# EAGLE design PUCY_Etap3 (EAGLE 5.11)
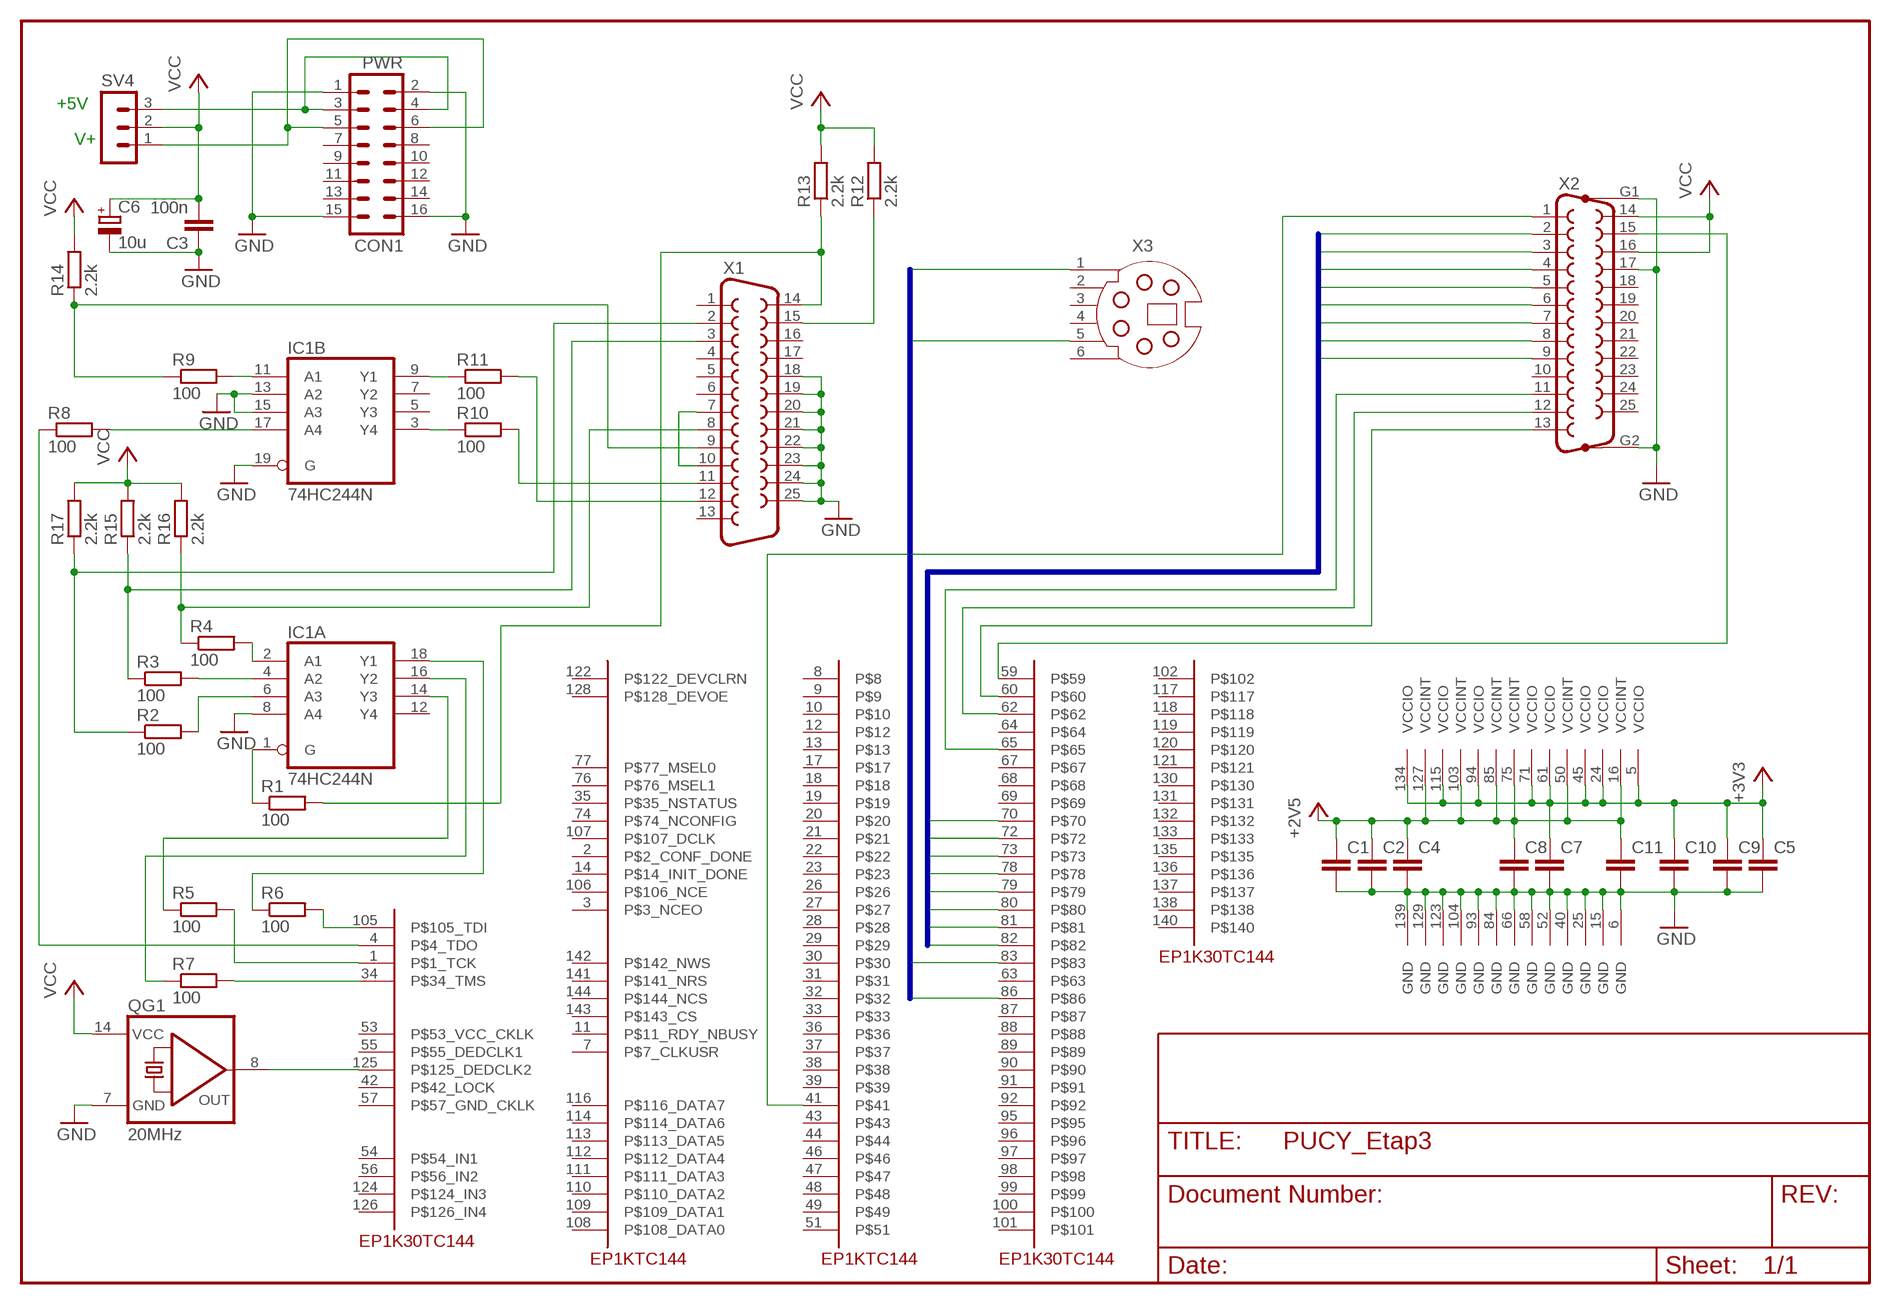
[diagram p0: schematic, sheet 1]

## Parts
C1  C-EUC0805  [C0805]
C2  C-EUC0805  [C0805]
C3  100n  C-EUC0805  [C0805]
C4  C-EUC0805  [C0805]
C5  C-EUC0805  [C0805]
C6  10u  CPOL-EUB/3528-21W  [B/3528-21W]
C7  C-EUC0805  [C0805]
C8  C-EUC0805  [C0805]
C9  C-EUC0805  [C0805]
C10  C-EUC0805  [C0805]
C11  C-EUC0805  [C0805]
CON1  PWR  ML16  [ML16]
IC1  74HC244N  [DIL20]
QG1  20MHz  QG5860  [DIL14S]
R1  100  R-EU_R0805  [R0805]
R2  100  R-EU_R0805  [R0805]
R3  100  R-EU_R0805  [R0805]
R4  100  R-EU_R0805  [R0805]
R5  100  R-EU_R0805  [R0805]
R6  100  R-EU_R0805  [R0805]
R7  100  R-EU_R0805  [R0805]
R8  100  R-EU_R0805  [R0805]
R9  100  R-EU_R0805  [R0805]
R10  100  R-EU_R0805  [R0805]
R11  100  R-EU_R0805  [R0805]
R12  2.2k  R-EU_R0805  [R0805]
R13  2.2k  R-EU_R0805  [R0805]
R14  2.2k  R-EU_R0805  [R0805]
R15  2.2k  R-EU_R0805  [R0805]
R16  2.2k  R-EU_R0805  [R0805]
R17  2.2k  R-EU_R0805  [R0805]
SV4  MA03-1  [MA03-1]
U$1  PAWLA_EP1K30TC144  [PAWLA_TQFP144]
X1  F25HP  [F25HP]
X2  F25HP  [F25HP]
X3  MDSSV-BC06  [SSV-BC06]

## Nets
+3V3: C5.1 C7.1 C9.1 C10.1 U$1.5(VCCIO) U$1.24(VCCIO) U$1.45(VCCIO) U$1.61(VCCIO) U$1.71(VCCIO) U$1.94(VCCIO) U$1.115(VCCIO) U$1.134(VCCIO)
+5V: C1.1 C2.1 C4.1 C8.1 C11.1 U$1.16(VCCINT) U$1.50(VCCINT) U$1.75(VCCINT) U$1.85(VCCINT) U$1.103(VCCINT) U$1.127(VCCINT) ; supply symbol labelled +2V5
GND: C1.2 C2.2 C3.1 C4.2 C5.2 C6.- C7.2 C8.2 C9.2 C10.2 C11.2 CON1.1 CON1.2 CON1.15 CON1.16 IC1.8(A:A4) IC1.13(B:A2) IC1.15(B:A3) IC1.19(B:G) QG1.7(GND) U$1.6(GND) U$1.15(GND) U$1.25(GND) U$1.40(GND) U$1.52(GND) U$1.58(GND) U$1.66(GND) U$1.84(GND) U$1.93(GND) U$1.104(GND) U$1.123(GND) U$1.129(GND) U$1.139(GND) X1.18 X1.19 X1.20 X1.21 X1.22 X1.23 X1.24 X1.25 X2.17 X2.G1 X2.G2
LPT_D0: U$1.70 X2.2
LPT_D1: U$1.72 X2.3
LPT_D2: U$1.73 X2.4
LPT_D3: U$1.78 X2.5
LPT_D4: U$1.79 X2.6
LPT_D5: U$1.80 X2.7
LPT_D6: U$1.81 X2.8
LPT_D7: U$1.82 X2.9
N$1: QG1.8(OUT) U$1.125(P$125_DEDCLK2)
N$2: IC1.14(A:Y3) R5.1
N$3: R5.2 U$1.1(P$1_TCK)
N$4: CON1.5 CON1.6 SV4.1
N$5: R7.2 U$1.34(P$34_TMS)
N$7: R6.2 U$1.105(P$105_TDI)
N$8: CON1.3 CON1.4 SV4.3
N$9: IC1.16(A:Y2) R7.1
N$10: R1.2 R13.1 X1.14
N$11: IC1.11(B:A1) R9.2
N$12: IC1.17(B:A4) R8.2
N$13: IC1.2(A:A1) R4.2
N$14: IC1.4(A:A2) R3.2
N$15: IC1.6(A:A3) R2.2
N$16: IC1.1(A:G) R1.1
N$17: R9.1 R14.1 X1.9
N$18: R4.1 R16.1 X1.8
N$19: R3.1 R15.1 X1.3
N$21: IC1.18(A:Y1) R6.1
N$22: R8.1 U$1.4(P$4_TDO)
N$23: IC1.3(B:Y4) R10.1
N$24: R10.2 X1.11
N$25: X1.7 X1.10
N$26: IC1.9(B:Y1) R11.1
N$27: R11.2 X1.12
N$28: R2.1 R17.1 X1.2
N$31: R12.1 X1.15
N$34: U$1.65 X2.11
N$35: U$1.62 X2.12
N$36: U$1.60 X2.13
N$37: U$1.59 X2.15
N$48: U$1.41 X2.1
PS_BUS0: U$1.83 X3.1
PS_BUS1: U$1.86 X3.5
VCC: C3.2 C6.+ QG1.14(VCC) R12.2 R13.2 R14.2 R15.2 R16.2 R17.2 SV4.2 X2.14 X2.16
Unconnected: CON1.7 CON1.8 CON1.9 CON1.10 CON1.11 CON1.12 CON1.13 CON1.14 IC1.5(B:Y3) IC1.7(B:Y2) IC1.12(A:Y4) U$1.2(P$2_CONF_DONE) U$1.3(P$3_NCEO) U$1.7(P$7_CLKUSR) U$1.8 U$1.9 U$1.10 U$1.11(P$11_RDY_NBUSY) U$1.12 U$1.13 U$1.14(P$14_INIT_DONE) U$1.17 U$1.18 U$1.19 U$1.20 U$1.21 U$1.22 U$1.23 U$1.26 U$1.27 U$1.28 U$1.29 U$1.30 U$1.31 U$1.32 U$1.33 U$1.35(P$35_NSTATUS) U$1.36 U$1.37 U$1.38 U$1.39 U$1.42(P$42_LOCK) U$1.43 U$1.44 U$1.46 U$1.47 U$1.48 U$1.49 U$1.51 U$1.53(P$53_VCC_CKLK) U$1.54(P$54_IN1) U$1.55(P$55_DEDCLK1) U$1.56(P$56_IN2) U$1.57(P$57_GND_CKLK) U$1.63 U$1.64 U$1.67 U$1.68 U$1.69 U$1.74(P$74_NCONFIG) U$1.76(P$76_MSEL1) U$1.77(P$77_MSEL0) U$1.87 U$1.88 U$1.89 U$1.90 U$1.91 U$1.92 U$1.95 U$1.96 U$1.97 U$1.98 U$1.99 U$1.100 U$1.101 U$1.102 U$1.106(P$106_NCE) U$1.107(P$107_DCLK) U$1.108(P$108_DATA0) U$1.109(P$109_DATA1) U$1.110(P$110_DATA2) U$1.111(P$111_DATA3) U$1.112(P$112_DATA4) U$1.113(P$113_DATA5) U$1.114(P$114_DATA6) U$1.116(P$116_DATA7) U$1.117 U$1.118 U$1.119 U$1.120 U$1.121 U$1.122(P$122_DEVCLRN) U$1.124(P$124_IN3) U$1.126(P$126_IN4) U$1.128(P$128_DEVOE) U$1.130 U$1.131 U$1.132 U$1.133 U$1.135 U$1.136 U$1.137 U$1.138 U$1.140 U$1.141(P$141_NRS) U$1.142(P$142_NWS) U$1.143(P$143_CS) U$1.144(P$144_NCS) X1.1 X1.4 X1.5 X1.6 X1.13 X1.16 X1.17 X2.10 X2.18 X2.19 X2.20 X2.21 X2.22 X2.23 X2.24 X2.25 X3.2 X3.3 X3.4 X3.6

## Buses
LPT_D[0..7]
PS_BUS[0..1]

## Notes on the sheet
- +5V
- V+

## Power pins joined to a net without a drawn wire
GND: IC1.10(P:GND)
VCC: IC1.20(P:VCC)

## Library data of the parts
C1 C2 C4 C5 C7-C11 = resistor:C-EU: CAPACITOR, European symbol
C3 = rcl:C-EU: CAPACITOR, European symbol
C6 = rcl:CPOL-EU: POLARIZED CAPACITOR, European symbol
CON1 = con-ml:ML16: HARTING
IC1 = 74xx-eu:74*244: Octal BUFFER and LINE DRIVER, 3-state
QG1 = crystal:QG5860: CRYSTAL RESONATOR; OC_FARNELL: unknown; OC_NEWARK: unknown
R1-R17 = rcl:R-EU_: RESISTOR, European symbol
SV4 = con-lstb:MA03-1: PIN HEADER
U$1 = EP1K30TC144:PAWLA_EP1K30TC144
X1 = con-subd:F25: SUB-D; OC_FARNELL: unknown; OC_NEWARK: unknown
X2 = con-subd:F25HP: SUB-D; OC_FARNELL: unknown; OC_NEWARK: unknown
X3 = con-yamaichi:MDSSV-BC06: YAMAICHI CONNECTOR; OC_FARNELL: unknown; OC_NEWARK: unknown

## Board
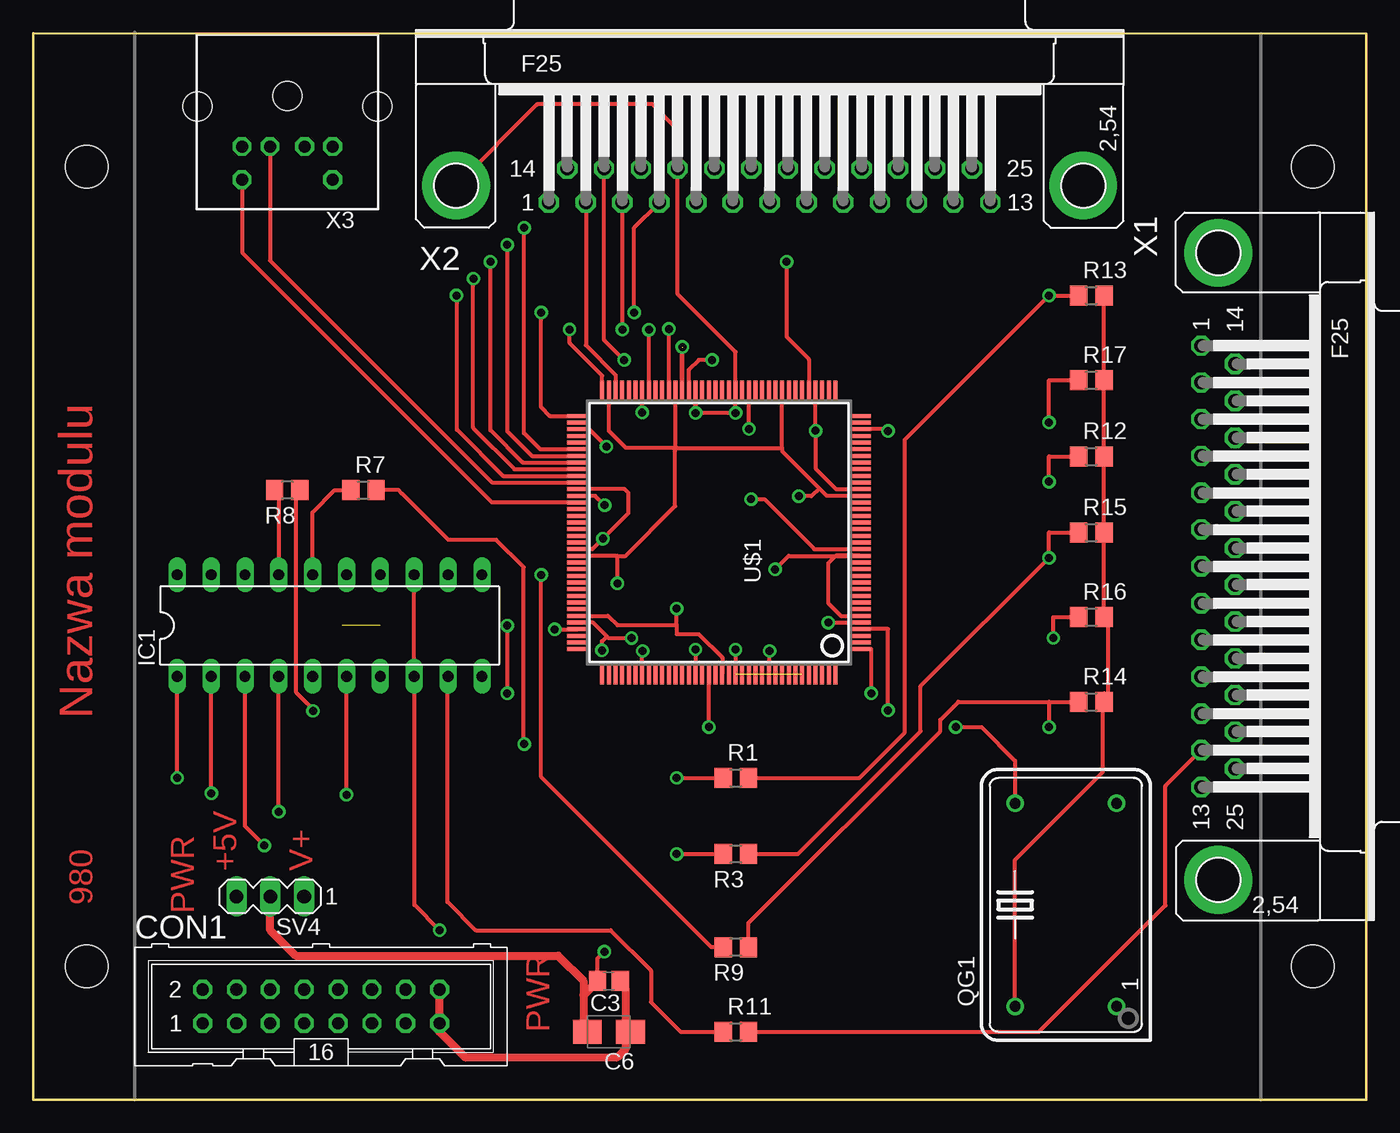
[diagram p1: board, top side]
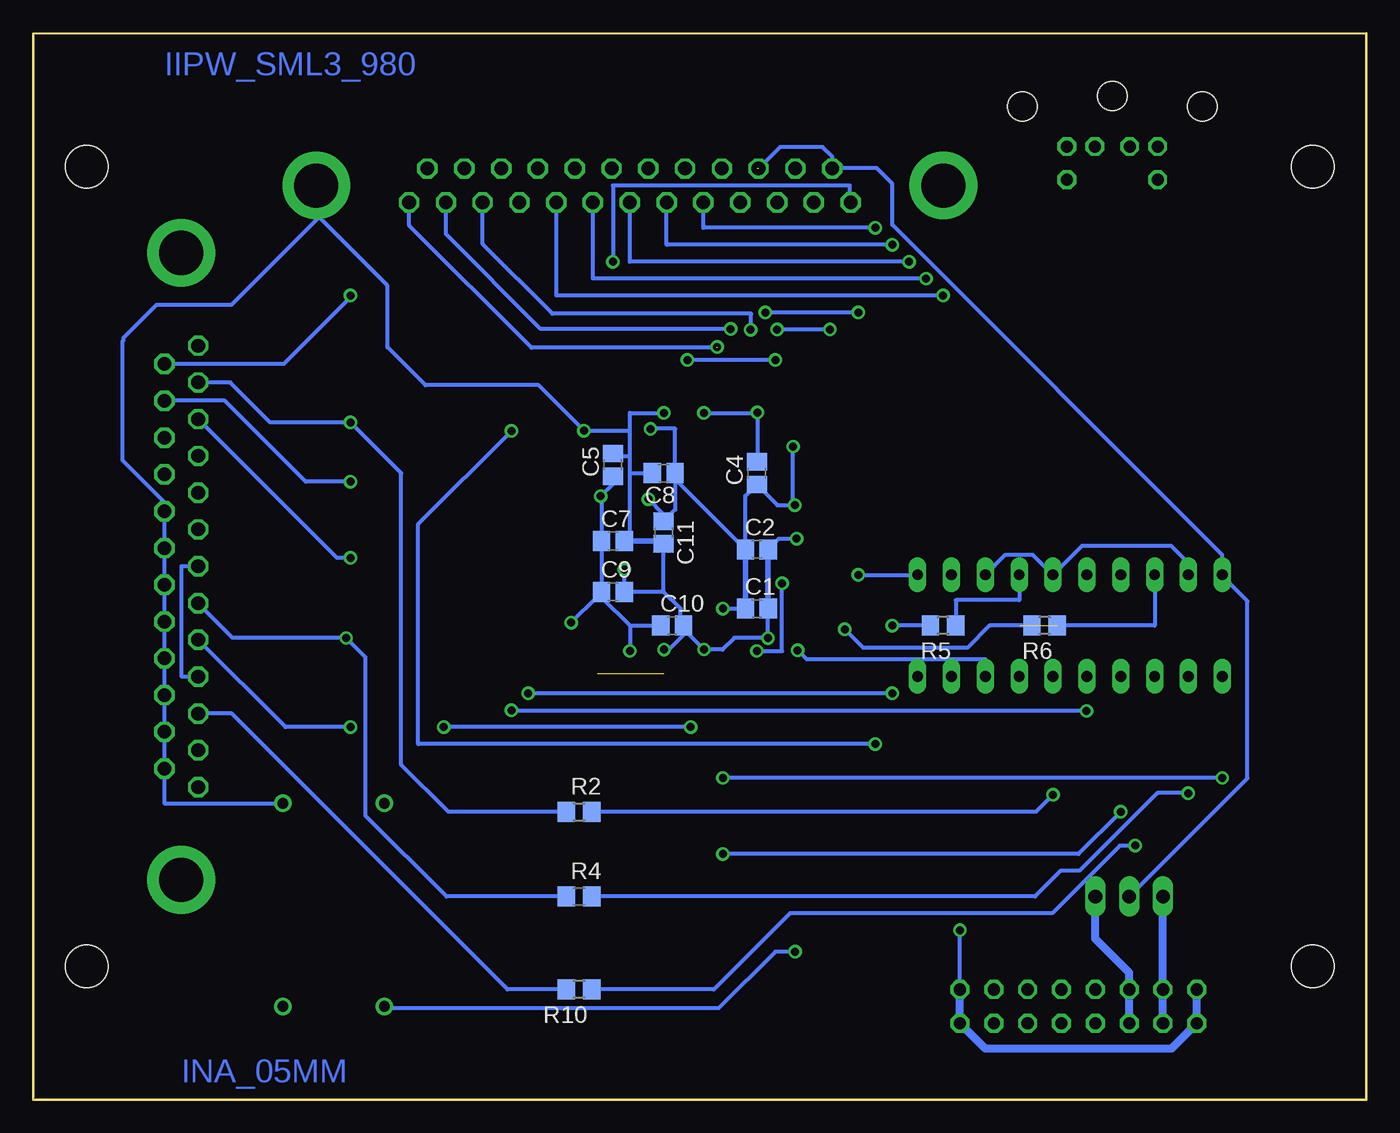
[diagram p2: board, bottom side, seen from below]

Size 100 x 80 mm. Coordinates in mm from the lower left corner, seen from the top.
Outline: 0,0 100,0 100,79.98 0,80 0,0
Copper layers (1*16): Top 0.035mm / dielectric 1.5mm / Bottom 0.035mm
Design rules "default *": minimum track width 10mil, minimum drill 23mil, track to track 5mil, track to pad 5mil, pad to pad 5mil, via to via 5mil, smd to smd 5mil, copper to edge 40mil, drill to drill 8mil, minimum pad ring 10mil, minimum via ring 8mil, stop-mask expansion 4mil, vias tented up to drill 0mil, thermal gap 10mil
Holes 3.2 mm at 4,10 4,70 96,10 96,70

### Footprints (pad centres in the part's own frame; a part is rotated, then mirrored left to right if it is on the bottom)
C0805 = smd 1.3 x 1.5: 1 -0.85,0; 2 0.85,0
B/3528-21W = smd 2.15 x 1.8: + 1.625,0; - -1.625,0
ML16 = drill 0.914 octagon: 1 -8.89,-1.27; 2 -8.89,1.27; 3 -6.35,-1.27; 4 -6.35,1.27; 5 -3.81,-1.27; 6 -3.81,1.27; 7 -1.27,-1.27; 8 -1.27,1.27; 9 1.27,-1.27; 10 1.27,1.27; 11 3.81,-1.27; 12 3.81,1.27; 13 6.35,-1.27; 14 6.35,1.27; 15 8.89,-1.27; 16 8.89,1.27
DIL20 = drill 0.813 long: 1 -11.43,-3.81; 2 -8.89,-3.81; 3 -6.35,-3.81; 4 -3.81,-3.81; 5 -1.27,-3.81; 6 1.27,-3.81; 7 3.81,-3.81; 8 6.35,-3.81; 9 8.89,-3.81; 10 11.43,-3.81; 11 11.43,3.81; 12 8.89,3.81; 13 6.35,3.81; 14 3.81,3.81; 15 1.27,3.81; 16 -1.27,3.81; 17 -3.81,3.81; 18 -6.35,3.81; 19 -8.89,3.81; 20 -11.43,3.81
DIL14S = drill 0.813 round: 1 -7.62,-3.81; 7 7.62,-3.81; 8 7.62,3.81; 14 -7.62,3.81
R0805 = smd 1.3 x 1.5: 1 -0.95,0; 2 0.95,0
MA03-1 = drill 1.016 long: 1 -2.54,0; 2 0,0; 3 2.54,0
PAWLA_TQFP144 = smd 0.3 x 1.6: 1 -8.75,-10.6; 2 -8.25,-10.6; 3 -7.75,-10.6; 4 -7.25,-10.6; 5 -6.75,-10.6; 6 -6.25,-10.6; 7 -5.75,-10.6; 8 -5.25,-10.6; 9 -4.75,-10.6; 10 -4.25,-10.6; 11 -3.75,-10.6; 12 -3.25,-10.6; 13 -2.75,-10.6; 14 -2.25,-10.6; 15 -1.75,-10.6; 16 -1.25,-10.6; 17 -0.75,-10.6; 18 -0.25,-10.6; 19 0.25,-10.6; 20 0.75,-10.6; 21 1.25,-10.6; 22 1.75,-10.6; 23 2.25,-10.6; 24 2.75,-10.6; 25 3.25,-10.6; 26 3.75,-10.6; 27 4.25,-10.6; 28 4.75,-10.6; 29 5.25,-10.6; 30 5.75,-10.6; 31 6.25,-10.6; 32 6.75,-10.6; 33 7.25,-10.6; 34 7.75,-10.6; 35 8.25,-10.6; 36 8.75,-10.6; 73 8.75,10.6; 74 8.25,10.6; 75 7.75,10.6; 76 7.25,10.6; 77 6.75,10.6; 78 6.25,10.6; 79 5.75,10.6; 80 5.25,10.6; 81 4.75,10.6; 82 4.25,10.6; 83 3.75,10.6; 84 3.25,10.6; 85 2.75,10.6; 86 2.25,10.6; 87 1.75,10.6; 88 1.25,10.6; 89 0.75,10.6; 90 0.25,10.6; 91 -0.25,10.6; 92 -0.75,10.6; 93 -1.25,10.6; 94 -1.75,10.6; 95 -2.25,10.6; 96 -2.75,10.6; 97 -3.25,10.6; 98 -3.75,10.6; 99 -4.25,10.6; 100 -4.75,10.6; 101 -5.25,10.6; 102 -5.75,10.6; 103 -6.25,10.6; 104 -6.75,10.6; 105 -7.25,10.6; 106 -7.75,10.6; 107 -8.25,10.6; 108 -8.75,10.6 | smd 1.6 x 0.3: 37 10.6,-8.75; 38 10.6,-8.25; 39 10.6,-7.75; 40 10.6,-7.25; 41 10.6,-6.75; 42 10.6,-6.25; 43 10.6,-5.75; 44 10.6,-5.25; 45 10.6,-4.75; 46 10.6,-4.25; 47 10.6,-3.75; 48 10.6,-3.25; 49 10.6,-2.75; 50 10.6,-2.25; 51 10.6,-1.75; 52 10.6,-1.25; 53 10.6,-0.75; 54 10.6,-0.25; 55 10.6,0.25; 56 10.6,0.75; 57 10.6,1.25; 58 10.6,1.75; 59 10.6,2.25; 60 10.6,2.75; 61 10.6,3.25; 62 10.6,3.75; 63 10.6,4.25; 64 10.6,4.75; 65 10.6,5.25; 66 10.6,5.75; 67 10.6,6.25; 68 10.6,6.75; 69 10.6,7.25; 70 10.6,7.75; 71 10.6,8.25; 72 10.6,8.75; 109 -10.6,8.75; 110 -10.6,8.25; 111 -10.6,7.75; 112 -10.6,7.25; 113 -10.6,6.75; 114 -10.6,6.25; 115 -10.6,5.75; 116 -10.6,5.25; 117 -10.6,4.75; 118 -10.6,4.25; 119 -10.6,3.75; 120 -10.6,3.25; 121 -10.6,2.75; 122 -10.6,2.25; 123 -10.6,1.75; 124 -10.6,1.25; 125 -10.6,0.75; 126 -10.6,0.25; 127 -10.6,-0.25; 128 -10.6,-0.75; 129 -10.6,-1.25; 130 -10.6,-1.75; 131 -10.6,-2.25; 132 -10.6,-2.75; 133 -10.6,-3.25; 134 -10.6,-3.75; 135 -10.6,-4.25; 136 -10.6,-4.75; 137 -10.6,-5.25; 138 -10.6,-5.75; 139 -10.6,-6.25; 140 -10.6,-6.75; 141 -10.6,-7.25; 142 -10.6,-7.75; 143 -10.6,-8.25; 144 -10.6,-8.75
F25HP = drill 1.016 octagon: 1 -16.561,-1.27; 2 -13.792,-1.27; 3 -11.049,-1.27; 4 -8.28,-1.27; 5 -5.512,-1.27; 6 -2.769,-1.27; 7 0,-1.27; 8 2.769,-1.27; 9 5.512,-1.27; 10 8.28,-1.27; 11 11.049,-1.27; 12 13.792,-1.27; 13 16.561,-1.27; 14 -15.189,1.27; 15 -12.421,1.27; 16 -9.652,1.27; 17 -6.909,1.27; 18 -4.14,1.27; 19 -1.372,1.27; 20 1.372,1.27; 21 4.14,1.27; 22 6.909,1.27; 23 9.652,1.27; 24 12.421,1.27; 25 15.189,1.27 | drill 3.302 pad 5.08 round: G1 -23.52,0; G2 23.52,0
SSV-BC06 = drill 0.9 octagon: 1 1.3,8.5; 2 -1.3,8.5; 3 3.4,8.5; 4 -3.4,8.5; 5 3.4,11; 6 -3.4,11 | hole 2.2: -6.75,5.5; 0,4.7; 6.75,5.5

### Placement (x,y rotation side)
C1  45.72,36.83 0 bottom
C2  45.72,41.27 0 bottom
C3  43.18,8.89 180 top
C4  45.72,46.99 90 bottom
C5  56.52,47.62 90 bottom
C6  43.18,5.08 180 top
C7  56.52,41.91 0 bottom
C8  52.7,46.99 180 bottom
C9  56.52,38.1 0 bottom
C10  52.07,35.56 0 bottom
C11  52.7,42.55 270 bottom
CON1  21.59,6.99 0 top
IC1  22.23,35.56 0 top
QG1  77.47,14.61 90 top
R1  52.7,24.13 0 top
R2  59.05,21.59 0 bottom
R3  52.7,18.41 180 top
R4  59.05,15.24 0 bottom
R5  31.75,35.56 180 bottom
R6  24.13,35.56 180 bottom
R7  24.77,45.72 0 top
R8  19.05,45.72 180 top
R9  52.7,11.43 180 top
R10  59.05,8.26 180 bottom
R11  52.7,5.08 0 top
R12  79.38,48.26 0 top
R13  79.38,60.33 0 top
R14  79.38,29.84 0 top
R15  79.38,42.55 0 top
R16  79.38,36.2 0 top
R17  79.38,53.98 0 top
SV4  17.78,15.24 180 top
U$1  51.44,42.55 90 top
X1  88.9,40.01 270 top
X2  55.24,68.58 0 top
X3  19.05,80.01 180 top

### Tracks (layer width: path | path; a pad name or v marks a point on that pad's centre or on a via)
+3V3  (via drill 0.6)
  Top 0.305: U$1.71 43.18,50.16 44.45,48.9 48.19,48.9 | 48.19,48.9 U$1.61 | 43.81,40.8 U$1.94 | v43.81,38.73 43.81,40.8 | v45.72,33.66 45.69,33.66 U$1.115 | v55.24,33.66 55.19,33.66 U$1.134 | U$1.45 | 56.19,48.9 56.19,48.64 58.97,45.86 | 56.19,48.9 U$1.45 | 58.97,45.86 59.52,45.3 U$1.24 | v57.43,45.26 58.37,45.26 58.97,45.86 | 48.32,48.9 56.19,48.9 | 48.32,48.9 48.19,48.9 | v59.65,35.79 U$1.5 | 48.32,48.9 48.16,48.73 48.16,44.51 44.44,40.8 43.81,40.8
  Bottom 0.305: v43.81,38.73 43.81,33.66 v45.72,33.66 | 55.24,35.56 C10.1 | 55.24,35.56 v55.24,33.66 | C5.1 56.52,46.18 v57.43,45.26 57.37,45.2 C7.1 C9.1 57.37,37.68 | 57.37,37.68 55.24,35.56 | 57.37,37.68 57.76,37.68 v59.65,35.79
+5V  (via drill 0.6)
  Top 0.305: 48.26,35.62 v48.26,36.83 | 48.26,35.62 48.26,34.92 49.92,34.92 51.69,33.16 U$1.127 | v53.7,50.32 53.69,50.32 U$1.50 | U$1.103 43.12,36.3 43.81,35.6 48.23,35.6 48.26,35.62 | v53.86,45.05 54.84,45.05 58.6,41.29 62.03,41.29 U$1.16 | U$1.85 42.16,45.3 v42.86,44.59 | U$1.75 41.69,50.3 v42.99,49
  Bottom 0.305: v48.26,36.83 C1.1 | C8.1 | C8.1 51.84,50.33 v53.7,50.33 v53.7,50.32 | 51.84,46.55 C8.1 | 51.84,46.55 C2.1 46.57,45.29 C4.1 44.17,44.59 v42.86,44.59 42.99,44.72 v42.99,49 | 51.84,46.55 51.84,44.26 C11.1 52.7,43.89 v53.86,45.05
  Bottom 0.406: C1.1 C2.1
GND  (via drill 0.6)  (1 unrouted)
  Top 0.305: IC1.13 IC1.8 28.59,14.59 v30.48,12.7 | X2.G1 37.81,74.66 46.46,74.66 48.31,72.81 48.31,69.85 X2.17 48.34,60.44 52.69,56.08 U$1.52 v52.69,51.51 49.69,51.51 U$1.58 v49.7,51.52 | v58.69,50.19 | v58.69,50.19 U$1.40 | v45.68,51.55 v45.69,51.55 U$1.66 | v49.68,33.77 U$1.123 | U$1.129 v52.69,33.75 v52.68,33.76 | v58.69,50.19 58.69,47.35 60.24,45.8 U$1.25 | U$1.6 60.59,36.3 59.63,37.26 59.63,40.22 60.21,40.8 62.02,40.8 U$1.15 56.67,40.8 v55.65,39.78 | v44.88,34.62 43.18,34.62 43.04,34.76 | 43.04,34.76 42.01,35.79 U$1.104 | U$1.93 41.95,41.3 v42.74,42.08 v42.74,42.09 44.65,44.01 44.65,45.52 44.37,45.8 U$1.84 | v42.66,33.71 42.66,34.38 43.04,34.76
  Top 0.61: CON1.16 CON1.15 30.48,5.08 32.38,3.17 43.81,3.17 44.45,3.81 44.45,5.08 | 44.45,5.08 C6.- | C3.1 43.81,8.89 44.45,8.26 44.45,5.08
  Bottom 0.305: 55.24,48.26 55.24,50.16 | 52.7,38.1 C9.2 55.65,38.11 v55.65,39.78 | IC1.8 28.57,33.02 33.66,33.02 | 33.66,33.02 IC1.10 | CON1.16 v30.48,12.7 | QG1.7 90.17,22.23 X1.25 X1.24 X1.23 X1.22 X1.21 X1.20 X1.19 X1.18 90.17,44.83 93.32,47.98 93.32,56.87 93.24,56.95 93.24,57.15 90.78,59.61 85.14,59.61 78.56,66.19 | 52.7,38.1 C11.2 | 55.24,48.26 56.52,48.26 | 55.24,46.99 55.24,48.26 | 55.24,46.99 C8.2 | X2.G2 78.77,66.4 78.56,66.19 | 78.56,66.19 73.43,61.06 73.43,56.44 70.59,53.59 62.09,53.59 v58.69,50.19 58.69,50.16 55.24,50.16 | v49.7,51.52 45.68,51.52 v45.68,51.55 45.68,47.84 C4.2 | v52.69,51.51 55.24,51.51 55.24,50.16 | 51,35.08 v49.68,33.77 49.67,33.76 48.28,33.76 47.41,34.63 44.87,34.63 | 51,35.08 51.44,35.52 51.44,35.56 51.44,36.83 52.7,38.1 | v52.68,33.76 52.32,33.76 51,35.08 | 55.24,46.99 55.24,42.33 C7.2 | 44.87,34.63 C1.2 | v44.88,34.62 44.87,34.63 | v42.74,42.08 44.07,42.08 C2.2 | 33.66,33.02 41.97,33.02 v42.66,33.71 | IC1.19 13.34,40.26 14.64,41.57 21.3,41.57 IC1.15 23.52,39.37 25.03,40.88 27.06,40.88 IC1.13
  Bottom 0.406: C1.2 C2.2 | 51.44,35.56 C10.2 | 56.52,48.26 C5.2 | C7.2 52.7,41.91 C11.2
  Bottom 0.61: CON1.16 CON1.15 28.57,3.81 14.61,3.81 CON1.1 CON1.2
LPT_D0
  Top 0.305: X2.2 41.45,56.59 43.69,54.36 U$1.70
LPT_D1  (via drill 0.6)
  Top 0.305: v44.2,57.78 X2.3 | v40.23,57.77 40.23,56.77 42.69,54.32 U$1.72 | U$1.72
  Bottom 0.305: v44.2,57.78 40.25,57.78 v40.23,57.77
LPT_D2  (via drill 0.6)
  Top 0.305: v45.09,59.05 45.09,65.43 X2.4 | U$1.73 38.75,51.3 38.1,51.94 v38.1,59.05
  Bottom 0.305: v38.1,59.05 v45.09,59.05
LPT_D3  (via drill 0.6)
  Top 0.305: U$1.78 38.02,48.8 36.82,50 36.82,65.39 v36.83,65.41
  Bottom 0.305: v36.83,65.41 49.73,65.41 X2.5
LPT_D4  (via drill 0.6)
  Top 0.305: U$1.79 37.41,48.3 35.57,50.13 35.57,64.12 v35.56,64.14
  Bottom 0.305: v35.56,64.14 52.48,64.14 X2.6
LPT_D5  (via drill 0.6)
  Top 0.305: U$1.80 36.71,47.8 34.29,50.22 v34.29,62.87
  Bottom 0.305: v34.29,62.87 55.24,62.87 X2.7
LPT_D6  (via drill 0.6)
  Top 0.305: U$1.81 36.11,47.3 33.01,50.39 33.01,61.58 v33.02,61.59
  Bottom 0.305: v33.02,61.59 58.01,61.59 X2.8
LPT_D7  (via drill 0.6)
  Top 0.305: U$1.82 35.25,46.8 31.77,50.27 31.77,60.3 v31.75,60.33
  Bottom 0.305: v31.75,60.33 60.76,60.33 X2.9
N$1  (via drill 0.6)
  Top 0.305: v50.69,27.94 U$1.125 | v69.22,27.94 71.13,27.94 73.66,25.41 QG1.8
  Bottom 0.305: v50.69,27.94 v69.22,27.94
N$2
  Bottom 0.305: IC1.14 26.04,37.47 30.8,37.47 R5.1
N$3  (via drill 0.6)
  Top 0.305: U$1.1 62.87,33.8 v62.87,30.48 | v35.56,35.56 v35.56,30.48
  Bottom 0.305: v35.56,30.48 v62.87,30.48 | R5.2 v35.56,35.56
N$4
  Bottom 0.61: CON1.5 CON1.6 17.78,9.53 20.32,12.06 SV4.1
N$5  (via drill 0.6)
  Top 0.305: U$1.34 64.14,50.3 v64.14,50.16 | R7.2 27.41,45.72 27.69,45.44 27.7,45.44 31.14,42 34.73,42 36.79,39.94 36.79,26.71 v36.83,26.67
  Bottom 0.305: v36.83,26.67 71.12,26.67 71.12,43.18 v64.14,50.16
N$7  (via drill 0.6)
  Top 0.305: v39.12,35.28 40.82,35.28 U$1.105
  Bottom 0.305: R6.2 28.26,35.56 29.93,33.88 37.72,33.88 v39.12,35.28
N$8
  Bottom 0.61: CON1.3 CON1.4 SV4.3
N$9
  Top 0.305: 23.5,45.72 R7.1 22.62,45.72 20.95,44.06 IC1.16
N$10  (via drill 0.6)
  Top 0.305: R13.1 v76.2,60.33 65.38,49.51 65.38,27.55 61.96,24.13 R1.2
  Bottom 0.305: v76.2,60.33 76.2,60.2 81.2,55.19 X1.14
N$11  (via drill 0.6)
  Top 0.305: R9.2 50.88,11.43 38.1,24.21 v38.1,39.37
  Bottom 0.305: v38.1,39.37 IC1.11
N$12
  Top 0.305: R8.2 18.41,45.72 IC1.17
N$13  (via drill 0.6)
  Top 0.305: v13.35,22.99 13.35,31.74 IC1.2
  Bottom 0.305: R4.2 24.85,15.24 22.94,17.16 21.5,17.16 15.66,23 v13.36,23 v13.35,22.99
N$14  (via drill 0.6)
  Top 0.305: v18.41,21.59 IC1.4 | v48.26,18.41 R3.2
  Bottom 0.305: v48.26,18.41 21.59,18.41 v18.41,21.59
N$15  (via drill 0.6)
  Top 0.305: v23.5,22.86 IC1.6
  Bottom 0.305: 58.42,21.59 R2.2 24.77,21.59 v23.5,22.86
N$16  (via drill 0.6)
  Top 0.305: v10.79,24.13 IC1.1 | v48.26,24.13 R1.1
  Bottom 0.305: v10.79,24.13 v48.26,24.13
N$17  (via drill 0.6)
  Top 0.305: 76.2,29.84 R14.1 | 76.2,29.84 v76.2,27.94 | R9.1 53.66,13.24 68.05,27.64 68.05,28.5 69.39,29.84 76.2,29.84
  Bottom 0.305: v76.2,27.94 81.08,27.94 X1.9
N$18  (via drill 0.6)
  Top 0.305: 78.4,36.22 R16.1 76.53,36.2 v76.53,34.63
  Bottom 0.305: X1.8 85.03,34.63 v76.53,34.63 75.07,33.17 75.07,21.3 69.01,15.24 R4.1
N$19  (via drill 0.6)
  Top 0.305: R15.1 76.2,42.55 v76.2,40.64 66.57,31.01 66.57,27.64 57.35,18.41 R3.1
  Bottom 0.305: v76.2,40.64 77.22,40.64 X1.3
N$21  (1 unrouted)
  Bottom 0.305: IC1.18 15.88,35.56 R6.1
N$22  (via drill 0.6)
  Top 0.305: U$1.4 64.14,35.3 v64.14,29.21 | v20.98,29.16 20.98,29.27 19.72,30.53 19.72,45.44 R8.1
  Bottom 0.305: v20.98,29.16 64.14,29.16 v64.14,29.21
N$23  (via drill 0.6)
  Top 0.305: IC1.3 15.88,20.51 v17.32,19.06
  Bottom 0.305: R10.1 48.93,8.26 43.22,13.97 23.56,13.97 18.49,19.04 17.35,19.04 v17.32,19.06
N$24
  Bottom 0.305: R10.2 64.43,8.26 85.13,28.96 X1.11
N$25
  Bottom 0.305: X1.7 88.9,40.01 88.9,31.75 87.63,31.75 X1.10
N$26
  Top 0.305: IC1.9 31.06,31.7 31.06,14.82 33.19,12.7 43.32,12.7 46.33,9.69 46.33,7.3 48.54,5.09 51.74,5.09 R11.1
N$27
  Top 0.305: 87.63,26.04 X1.12 84.94,23.52 84.94,14.57 75.45,5.08 R11.2
N$28  (via drill 0.6)
  Top 0.305: R17.1 76.2,53.98 v76.2,50.8
  Bottom 0.305: X1.2 87.62,53.81 85.23,53.81 82.22,50.8 v76.2,50.8 72.39,46.99 72.39,25.12 68.86,21.59 R2.1
N$31  (via drill 0.6)
  Top 0.305: v76.2,46.35 76.2,48.26 R12.1
  Bottom 0.305: v76.2,46.35 79.55,46.35 85.64,52.44 90.16,52.44 X1.15
N$34  (via drill 0.6)
  Top 0.305: U$1.65 46.18,53.15 v46.18,57.76
  Bottom 0.305: v46.18,57.76 46.15,57.76 46.15,58.95 61.05,58.95 66.28,64.19 66.28,67.3 X2.11
N$35  (via drill 0.6)
  Top 0.305: U$1.62 47.68,53.15 v47.68,57.82
  Bottom 0.305: v47.68,57.82 61.92,57.82 69.04,64.94 X2.12
N$36  (via drill 0.6)  (2 unrouted)
  Top 0.305: v48.69,56.46 U$1.60 v48.69,56.46
  Bottom 0.305: X2.13 71.81,65.58 62.64,56.41 48.69,56.41 v48.69,56.46
N$37  (via drill 0.6)
  Top 0.305: X2.15 42.82,57 v44.32,55.5 | v50.93,55.5 49.94,55.5 49.17,54.74 49.17,53.16 U$1.59
  Bottom 0.305: v44.32,55.5 v50.93,55.5
N$48  (via drill 0.6)
  Top 0.305: v56.52,62.87 56.52,57.23 58.19,55.55 U$1.41
  Bottom 0.305: X2.1 38.73,67.31 38.73,68.58 56.52,68.58 v56.52,62.87
PS_BUS0
  Top 0.305: X3.1 17.75,62.96 34.4,46.3 40.83,46.3 U$1.83
PS_BUS1
  Top 0.305: U$1.86 34.41,44.8 15.7,63.51 15.7,68.96 X3.5
VCC  (via drill 0.6)  (1 unrouted)
  Top 0.305: R13.2 R17.2 R12.2 R15.2 R16.2 80.64,36.2 80.64,30.48 80.33,30.48 R14.2 80.24,29.76 80.24,24.57 73.66,18 QG1.14 | C3.2 42.33,10.58 v42.85,11.1
  Top 0.61: C6.+ 41.27,5.08 41.27,7.83 | 41.27,7.83 C3.2 | 41.27,7.83 41.27,8.89 39.37,10.79 19.68,10.79 17.78,12.7 SV4.2
  Bottom 0.305: SV4.2 8.91,24.11 8.91,37.39 10.79,39.27 IC1.20 10.79,40.87 35.56,65.63 35.56,68.71 36.72,69.86 40.04,69.86 X2.14 40.06,70.74 40.78,71.46 43.98,71.46 X2.16 | v42.85,11.1 44.34,11.1 48.58,6.86 73.53,6.86 QG1.14

### Text on the board
Top: Nazwa modulu | +5V | V+ | 980 | PWR | PWR
Bottom: IIPW_SML3_980 | INA_05MM